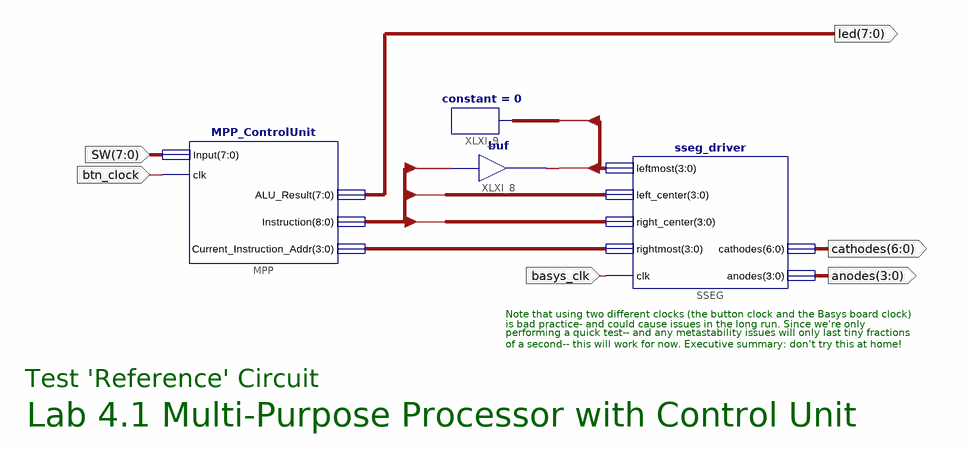
[diagram p0: schematic sheet 1]
// Xilinx ISE schematic MPPTestCircuit.sch (spartan3e) as structural Verilog: 4 symbols, 6 ports
module MPPTestCircuit (
  input  [7:0] SW,
  input  btn_clock,
  input  basys_clk,
  output [3:0] anodes,
  output [6:0] cathodes,
  output [7:0] led
);

  wire [3:0] leftmost, XLXN_19;
  wire [8:0] Instruction;

  MPP_ControlUnit MPP (
    .Current_Instruction_Addr(XLXN_19), .Input(SW), .clk(btn_clock), .ALU_Result(led),
    .Instruction(Instruction));
  buf XLXI_8 (leftmost[0], Instruction[8]);
  constant #(.CValue("0")) XLXI_9 (.O(leftmost[3:1]));
  sseg_driver SSEG (
    .right_center(Instruction[3:0]), .rightmost(XLXN_19), .clk(basys_clk), .left_center(Instruction[7:4]),
    .leftmost(leftmost), .anodes(anodes), .cathodes(cathodes));

  // Notes on the sheet:
  //   Note that using two different clocks (the button clock and the Basys board clock)
  //   is bad practice- and could cause issues in the long run. Since we're only
  //   performing a quick test-- and any metastability issues will only last tiny fractions
  //   of a second-- this will work for now. Executive summary: don't try this at home!
  //   Test 'Reference' Circuit
  //   Lab 4.1 Multi-Purpose Processor with Control Unit
endmodule
